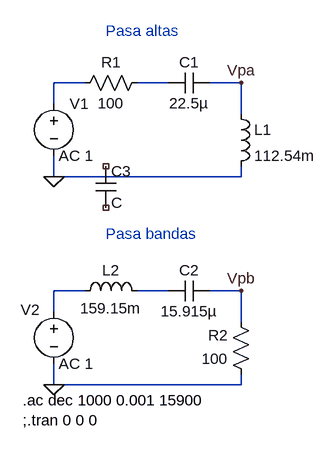
[diagram p0: schematic act_reto_t9.asc]
act_reto_t9.asc, the LTspice schematic file:
Version 4.1
SHEET 1 880 680
WIRE 0 -96 -48 -96
WIRE 128 -96 80 -96
WIRE 240 -96 192 -96
WIRE -48 -64 -48 -96
WIRE 240 -48 240 -96
WIRE -48 48 -48 16
WIRE 240 48 240 32
WIRE 240 48 -48 48
WIRE 0 224 -48 224
WIRE 128 224 80 224
WIRE 240 224 192 224
WIRE -48 256 -48 224
WIRE 240 272 240 224
WIRE -48 368 -48 336
WIRE 240 368 240 352
WIRE 240 368 -48 368
FLAG -48 48 0
FLAG -48 368 0
FLAG 240 -96 Vpa
FLAG 240 224 Vpb
SYMBOL res 96 -112 R90
WINDOW 0 0 56 VBottom 2
WINDOW 3 32 56 VTop 2
SYMATTR InstName R1
SYMATTR Value 100
SYMBOL ind 224 -64 R0
SYMATTR InstName L1
SYMATTR Value 112.54m
SYMBOL cap 192 -112 R90
WINDOW 0 0 32 VBottom 2
WINDOW 3 32 32 VTop 2
SYMATTR InstName C1
SYMATTR Value 22.5µ
SYMBOL voltage -48 -80 R0
WINDOW 123 7 96 Left 2
WINDOW 39 0 0 Left 0
SYMATTR Value2 AC 1
SYMATTR InstName V1
SYMATTR Value ""
SYMBOL res 256 368 R180
WINDOW 0 36 76 Left 2
WINDOW 3 36 40 Left 2
SYMATTR InstName R2
SYMATTR Value 100
SYMBOL ind -16 240 R270
WINDOW 0 32 56 VTop 2
WINDOW 3 5 56 VBottom 2
SYMATTR InstName L2
SYMATTR Value 159.15m
SYMBOL cap 192 208 R90
WINDOW 0 0 32 VBottom 2
WINDOW 3 32 32 VTop 2
SYMATTR InstName C2
SYMATTR Value 15.915µ
SYMBOL voltage -48 240 R0
WINDOW 0 -51 13 Left 2
WINDOW 123 7 96 Left 2
WINDOW 39 0 0 Left 0
SYMATTR InstName V2
SYMATTR Value2 AC 1
SYMATTR Value ""
SYMBOL cap 16 32 R0
SYMATTR InstName C3
TEXT -96 392 Left 2 !.ac dec 1000 0.001 15900\n;.tran 0 0 0
TEXT 32 -176 Left 2 ;Pasa altas
TEXT 32 136 Left 2 ;Pasa bandas

The netlist it stands for:
* act_reto_t9.asc
R1 N002 N001 100
L1 Vpa 0 112.54m
C1 Vpa N002 22.5µ
V1 N001 0 AC 1
R2 0 Vpb 100
L2 N003 N004 159.15m
C2 Vpb N004 15.915µ
V2 N003 0 AC 1
C3 NC_01 NC_02 C
.ac dec 1000 0.001 15900
;.tran 0 0 0
* Pasa altas
* Pasa bandas
.backanno
.end